# Altium schematic sheet display.SchDoc
size A4; SheetNumber: 8; SheetTotal: 8
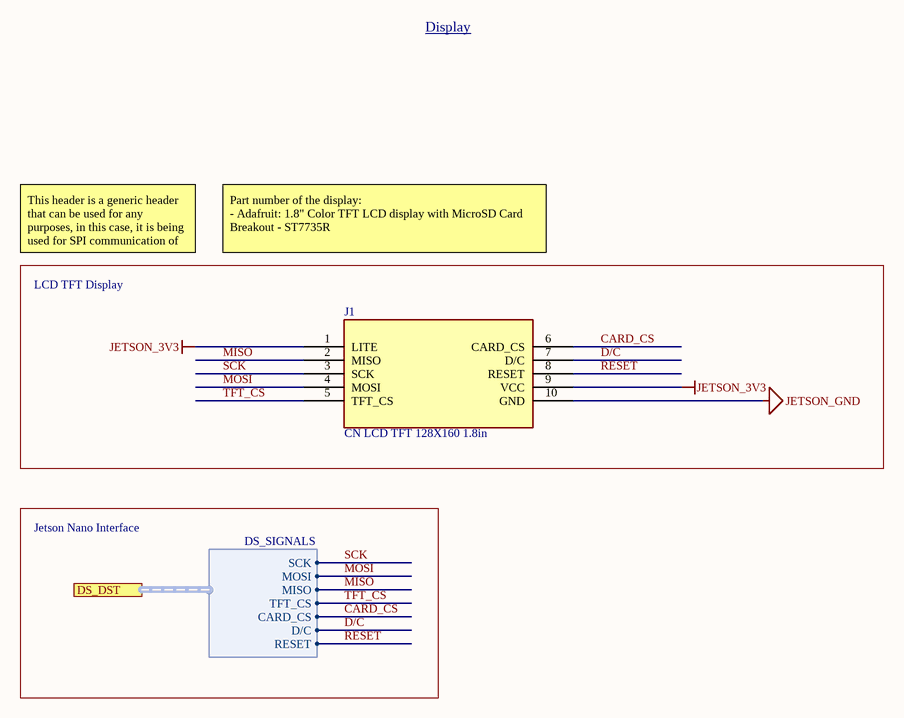
[diagram p0: display.SchDoc]

## Parts
J1  CN LCD TFT 128X160 1.8in  [CN LCD TFT 128X160 1.8in]

## Blocks framed on the sheet
LCD TFT Display: J1

## Ports
DS_DST (harness DS_SIGNALS)

## Harnesses
DS_SIGNALS: SCK, MOSI, MISO, TFT_CS, CARD_CS, D/C, RESET

## Nets
JETSON_3V3: J1.1(LITE) J1.9(VCC)
JETSON_GND: J1.10(GND)
CARD_CS: J1.6(CARD_CS) ; port DS_DST.CARD_CS
D/C: J1.7(D/C) ; port DS_DST.D/C
MISO: J1.2(MISO) ; port DS_DST.MISO
MOSI: J1.4(MOSI) ; port DS_DST.MOSI
RESET: J1.8(RESET) ; port DS_DST.RESET
SCK: J1.3(SCK) ; port DS_DST.SCK
TFT_CS: J1.5(TFT_CS) ; port DS_DST.TFT_CS

## Notes on the sheet
- Display
- This header is a generic header that can be used for any purposes, in this case, it is being used for SPI communication of the display
- Part number of the display:
  - Adafruit: 1.8" Color TFT LCD display with MicroSD Card Breakout - ST7735R
- Jetson Nano Interface

## Library data of the parts
J1 = CN LCD TFT 128X160 1.8in: Graphic LCD Display Module Transmissive Red, Green, Blue (RGB) TFT - Color SPI 1.8" (45.72mm) 128 x 160; Manufacturer Part Number 1: 358; Part Number: CN LCD TFT 128X160 1.8in; Supplier 1: Digi-Key; Supplier Part Number 1: 1528-1536-ND; Supplier URL 1: https://www.digikey.ca/en/products/detail/adafruit-industries-llc/358/5801368; Pin Count: 10